# EAGLE schematic master_node_leonardo (EAGLE 6.5.0)
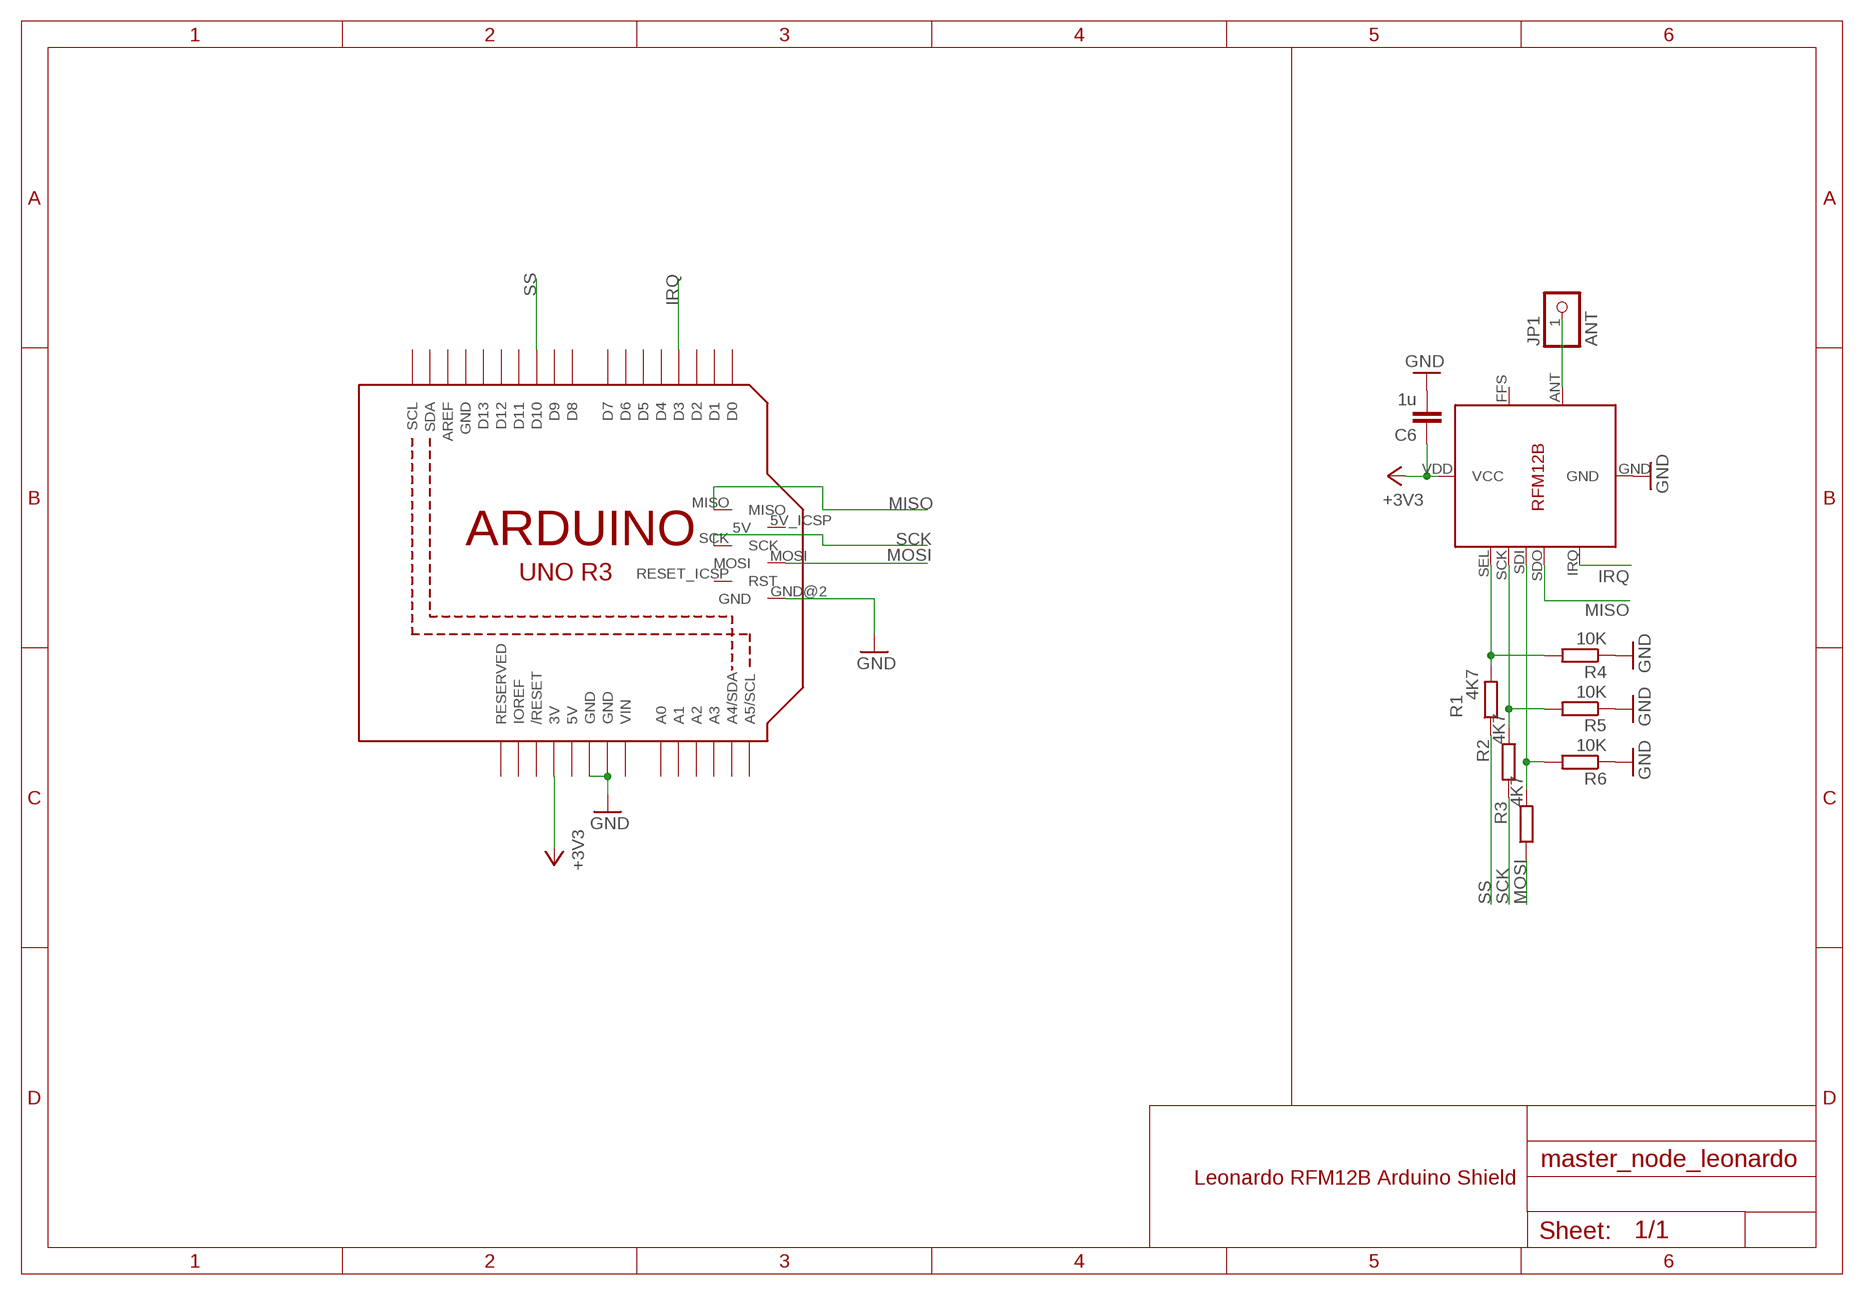
[diagram p0: schematic, sheet 1]

## Parts
C6  1u  CAP0805  [0805]
JP1  ANT  PINHD-1X1  [1X01]
R1  4K7  R-EU_0204/7  [0204/7]
R2  4K7  R-EU_0204/7  [0204/7]
R3  4K7  R-EU_0204/7  [0204/7]
R4  10K  R-EU_0204/7  [0204/7]
R5  10K  R-EU_0204/7  [0204/7]
R6  10K  R-EU_0204/7  [0204/7]
U$1  RFM12B  [RFM12B]
U$2  ARDUINO_R3_ICSP  [ARDUINOR3_ICSP]

## Nets
+3V3: C6.1 U$1.VDD(VCC) U$2.3V
GND: C6.2 R4.1 R5.1 R6.1 U$1.GND U$2.GND@1(GND) U$2.GND@2(GND) U$2.GND@3(GND)
IRQ: U$1.IRQ U$2.D3
MISO: U$1.SDO U$2.MISO
MOSI: R3.1 U$2.MOSI
N$7: JP1.1 U$1.ANT
N$35: R3.2 R6.2 U$1.SDI
N$36: R2.2 R5.2 U$1.SCK
N$37: R1.2 R4.2 U$1.SEL
SCK: R2.1 U$2.SCK
SS: R1.1 U$2.D10
Unconnected: U$1.FFS U$2.5V_ICSP(5V) U$2.A0 U$2.A1 U$2.A2 U$2.A3 U$2.A4(A4/SDA) U$2.A5(A5/SCL) U$2.AREF U$2.D0 U$2.D1 U$2.D2 U$2.D4 U$2.D5 U$2.D6 U$2.D7 U$2.D8 U$2.D9 U$2.D11 U$2.D12 U$2.D13 U$2.IOREF U$2.RESERVED U$2.RESET(/RESET) U$2.RESET_ICSP(RST) U$2.SCL U$2.SDA

## Notes on the sheet
- Leonardo RFM12B Arduino Shield

## Power pins joined to a net without a drawn wire
5V: U$2.5V
GND: U$2.GND
VIN: U$2.VIN

## Library data of the parts
C6 = SparkFun-Passives:CAP: Capacitor Standard 0603 ceramic capacitor, and 0.1" leaded capacitor.
JP1 = pinhead:PINHD-1X1: PIN HEADER
R1-R6 = resistor:R-EU_: RESISTOR, European symbol
U$1 = JeeParts:RFM12B
U$2 = adafruit:ARDUINO_R3_ICSP